# EasyEDA Pro project FLIGHT-CONTROLLER-Final_VERSION-1.eprj

# Schematic FLIGHT CONTROLLER
Board Name: FLIGHT CONTROLLER; Create Date: 2025-07-13; Page Name: Sheet_1; Project Name: FLIGHT-CONTROLLER-Final_VERSION-1; Schematic Name: FLIGHT CONTROLLER; Update Date: 2025-07-13; Add into BOM: yes; Company: Your Company; Convert to PCB: yes; Date: 2025-07-08; Draw By: Jinalka Herath; REV: 1.0; Sheet: 1/1; spicePre: .
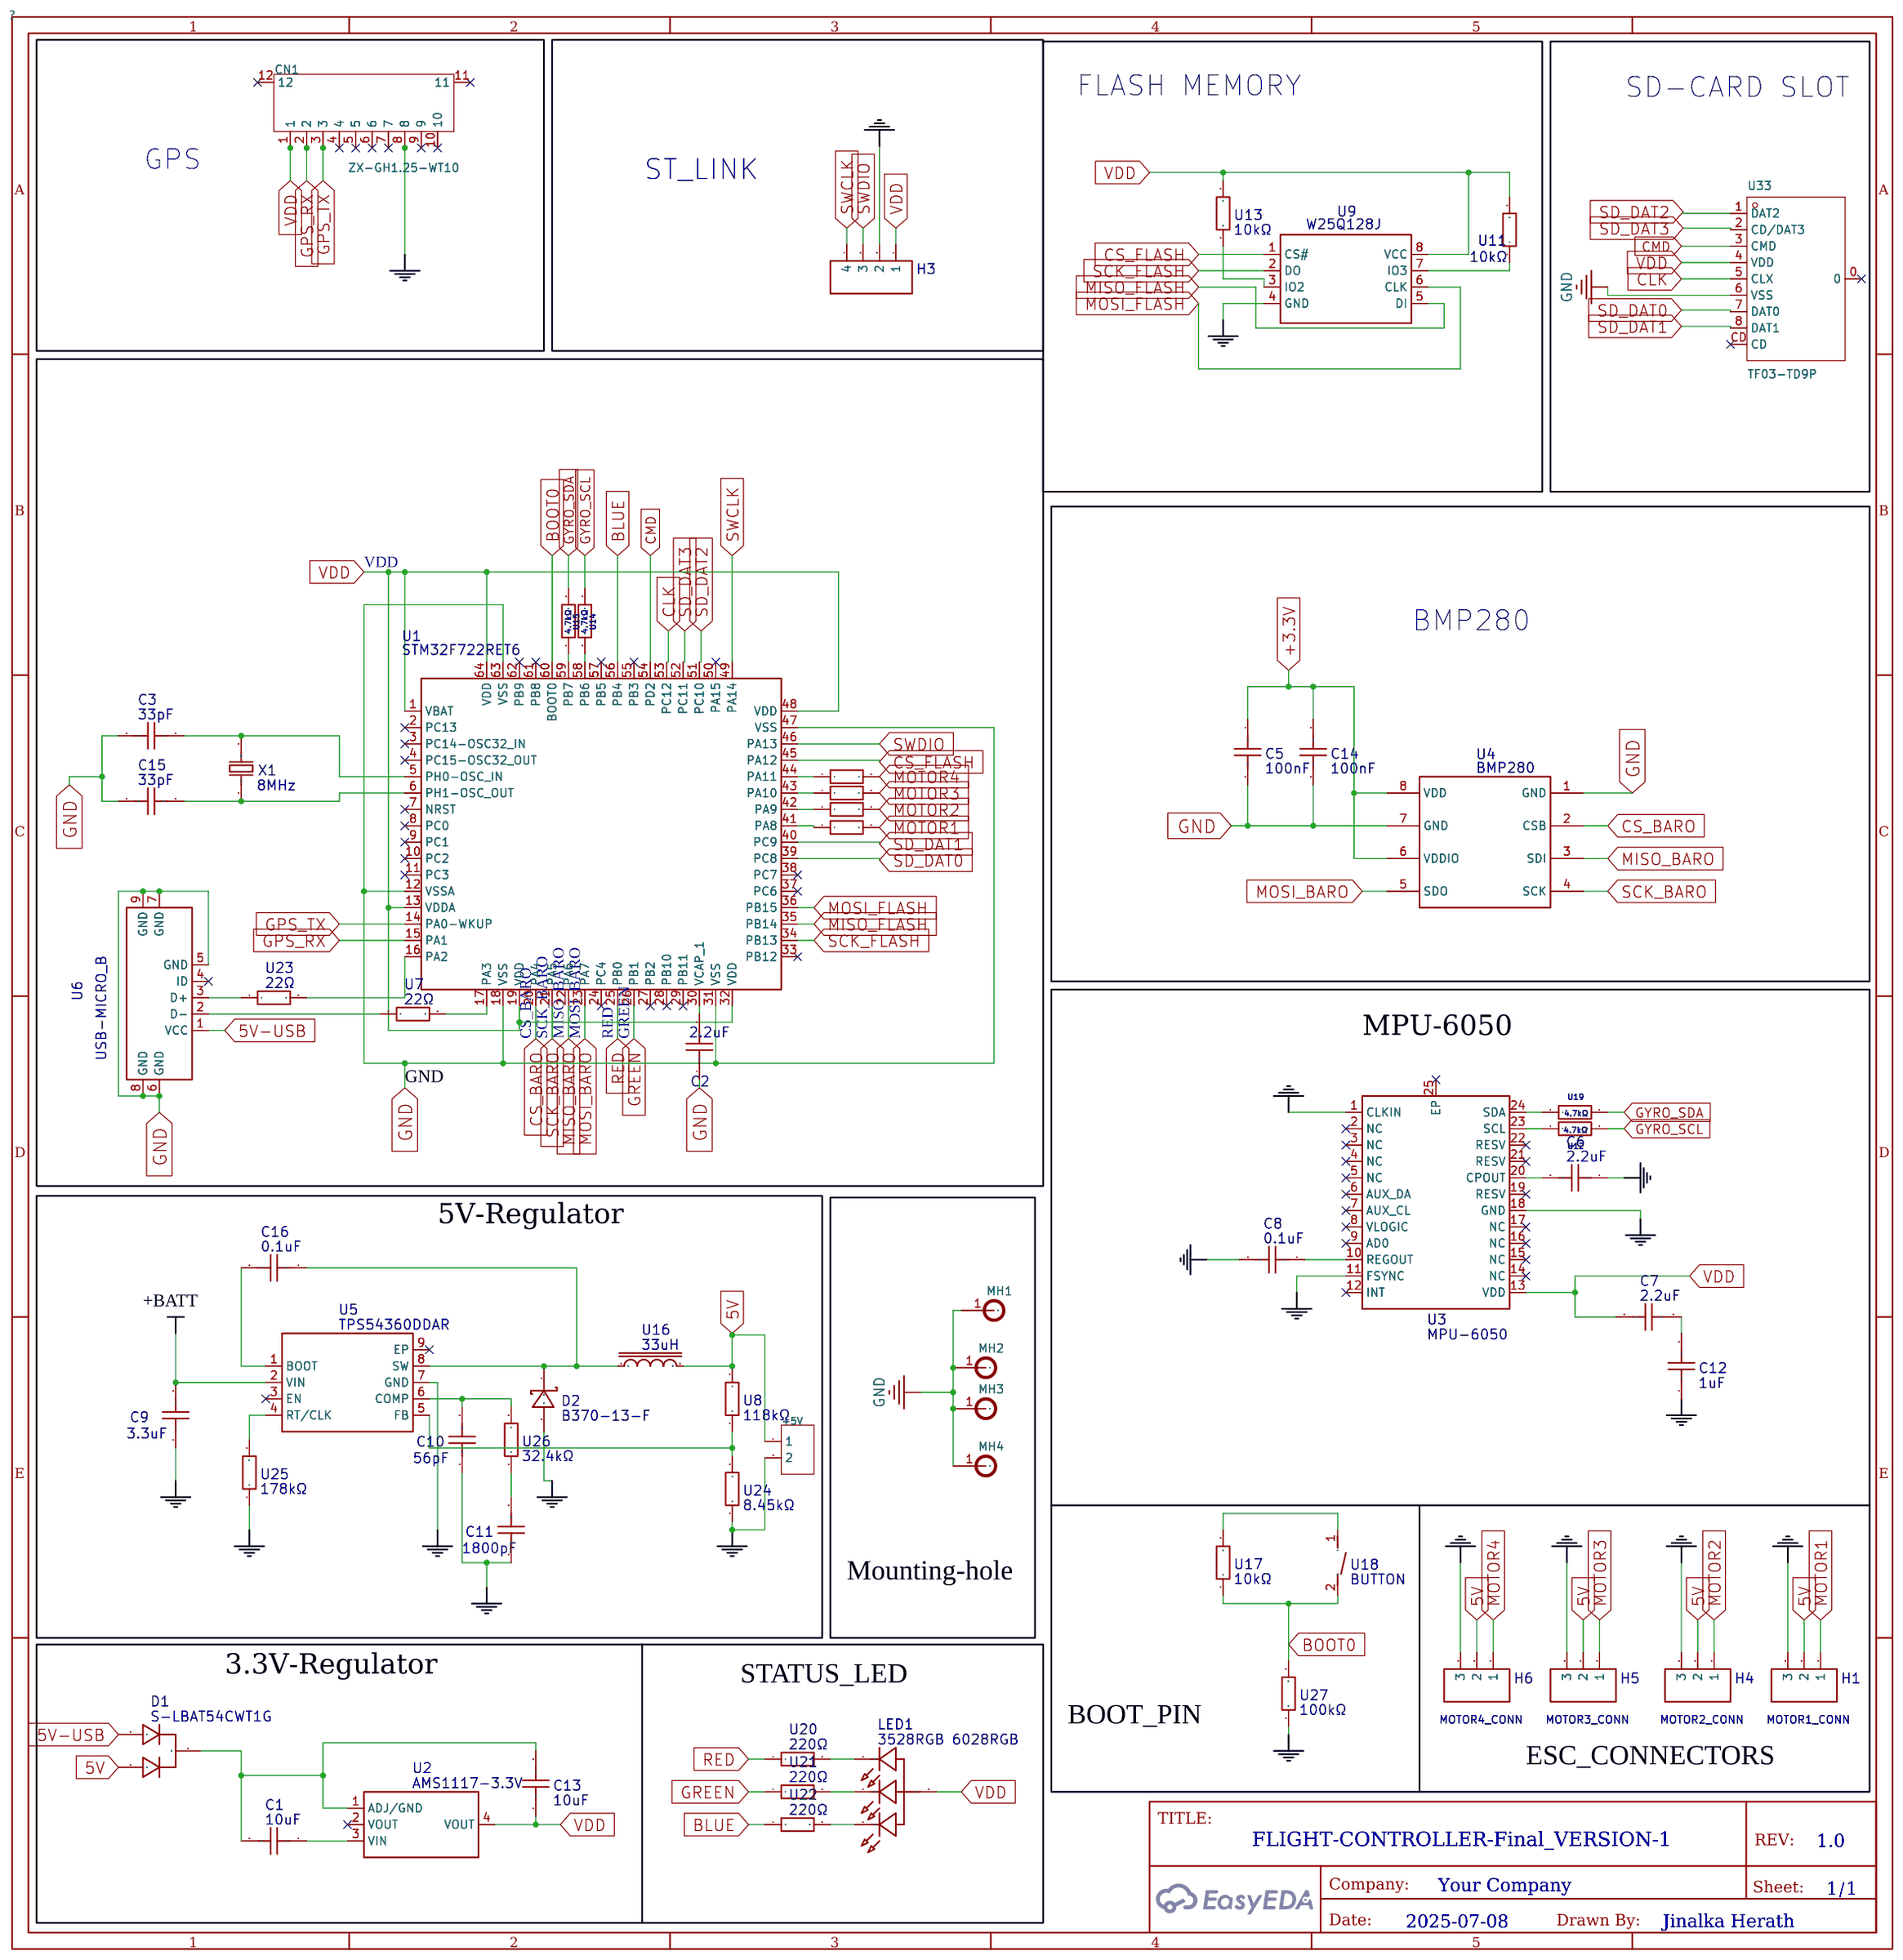
[diagram p0: schematic sheet]

## Parts
+5V  -  [HDR-TH_2P-P2.54-V-F]
C1  10uF  [C0603]
C2  2.2uF  [CAP-SMD_L3.2-W2.5-1]
C3  33pF  [C0603]
C5  100nF  [C0603]
C6  2.2uF  [C0603]
C7  2.2uF  [C0603]
C8  0.1uF  [C0603]
C9  3.3uF  [C0603]
C10  56pF  [C0603]
C11  1800pF  [C0603]
C12  1uF  [C0603]
C13  10uF  [C0603]
C14  100nF  [C0603]
C15  33pF  [C0603]
C16  0.1uF  [C0603]
CN1  ZX-GH1.25-WT10  [CONN-SMD_ZX-GH1.25-WT10]
D1  S-LBAT54CWT1G  [SC-70-3_L2.0-W1.3-P1.30-LS2.1-BR]
D2  B370-13-F  [SMC_L7.1-W6.2-LS8.1-RD]
H1  MOTOR1_CONN  [HDR-F-2.54_1X3]
H3  ST_LINK  [HDR-F-2.54_1X4]
H4  MOTOR2_CONN  [HDR-F-2.54_1X3]
H5  MOTOR3_CONN  [HDR-F-2.54_1X3]
H6  MOTOR4_CONN  [HDR-F-2.54_1X3]
LED1  3528RGB 6028RGB  [LED-SMD_4P-L3.5-W2.8_3528RGB-6028RGB]
MH1  -  [MH_7.5]  (no BOM)
MH2  -  [MH_7.5]  (no BOM)
MH3  -  [MH_7.5]  (no BOM)
MH4  -  [MH_7.5]  (no BOM)
U1  STM32F722RET6  [LQFP-64_L10.0-W10.0-P0.50-LS12.0-BL]
U2  AMS1117-3.3V  [SOT-223-4_L6.5-W3.5-P2.30-LS7.0-BR]
U3  MPU-6050  [QFN-24_L4.0-W4.0-P0.50-BL-EP2.7]
U4  BMP280  [LGA-8_L2.5-W2.0-P0.65_AMP6127]
U5  TPS54360DDAR  [ESOP-8_L4.9-W3.9-P1.27-LS6.0-BL-EP]
U6  USB-MICRO_B  [MICRO-USB-SMD_USB-MICRO_B]
U7  22Ω  [RES-TH_BD2.3-L3.7-P7.70-D0.9]
U8  118kΩ  [RES-TH_BD2.3-L3.7-P7.70-D0.9]
U9  W25Q128J  [SOIC-8_L5.3-W5.3-P1.27-LS8.0-BL]
U11  10kΩ  [RES-TH_BD2.3-L3.7-P7.70-D0.9]
U12  4.7kΩ  [RES-TH_BD2.3-L3.7-P7.70-D0.9]
U13  10kΩ  [RES-TH_BD2.3-L3.7-P7.70-D0.9]
U14  4.7kΩ  [RES-TH_BD2.3-L3.7-P7.70-D0.9]
U15  4.7kΩ  [RES-TH_BD2.3-L3.7-P7.70-D0.9]
U16  33uH  [IND-SMD_L8.5-W8.0_SMS0850]
U17  10kΩ  [RES-TH_BD2.3-L3.7-P7.70-D0.9]
U18  BUTTON  [KEY-SMD_L6.0-W6.0-LS6.6]
U19  4.7kΩ  [RES-TH_BD2.3-L3.7-P7.70-D0.9]
U20  220Ω  [RES-TH_BD2.3-L3.7-P7.70-D0.9]
U21  220Ω  [RES-TH_BD2.3-L3.7-P7.70-D0.9]
U22  220Ω  [RES-TH_BD2.3-L3.7-P7.70-D0.9]
U23  22Ω  [RES-TH_BD2.3-L3.7-P7.70-D0.9]
U24  8.45kΩ  [RES-TH_BD2.3-L3.7-P7.70-D0.9]
U25  178kΩ  [RES-TH_BD2.3-L3.7-P7.70-D0.9]
U26  32.4kΩ  [RES-TH_BD2.3-L3.7-P7.70-D0.9]
U27  100kΩ  [RES-TH_BD2.3-L3.7-P7.70-D0.9]
U28  100Ω  [RES-TH_BD2.3-L3.7-P7.70-D0.9]
U29  100Ω  [RES-TH_BD2.3-L3.7-P7.70-D0.9]
U30  100Ω  [RES-TH_BD2.3-L3.7-P7.70-D0.9]
U33  TF03-TD9P  [CONN-SMD_TF-001A-P]
U34  100Ω  [RES-TH_BD2.3-L3.7-P7.70-D0.9]
X1  8MHz  [CRYSTAL-SMD_L3.2-W2.5_3225-8MHZ]

## Library data of the parts
+5V = HDR-F_2.54_1x2P: Supplier Footprint: Through
C1 C13 = 10uF: Supplier: LCSC; Supplier Part: C3884822; Manufacturer: TDK; Manufacturer Part: C1608CH2A560J080AA; JLCPCB Part Class: Extended Part; Contributor: lcsc; nameAlias: Value; spicePre: C; spiceSymbolName: C1608CH2A560J080AA
C2 = 2.2uF: Supplier: LCSC; Supplier Part: C3778570; Manufacturer: rubycon(红宝石); Manufacturer Part: 25MU225MB23225; JLCPCB Part Class: Extended Part; Contributor: lcsc; nameAlias: Value; spicePre: C; spiceSymbolName: 25MU225MB23225
C3 C15 = 33pF: Supplier: LCSC; Supplier Part: C3884822; Manufacturer: TDK; Manufacturer Part: C1608CH2A560J080AA; JLCPCB Part Class: Extended Part; Contributor: lcsc; nameAlias: Value; spicePre: C; spiceSymbolName: C1608CH2A560J080AA
C5 C14 = 100nF: Supplier: LCSC; Supplier Part: C3884822; Manufacturer: TDK; Manufacturer Part: C1608CH2A560J080AA; JLCPCB Part Class: Extended Part; Contributor: lcsc; nameAlias: Value; spicePre: C; spiceSymbolName: C1608CH2A560J080AA
C6 C7 = 2.2uF: Supplier: LCSC; Supplier Part: C3884822; Manufacturer: TDK; Manufacturer Part: C1608CH2A560J080AA; JLCPCB Part Class: Extended Part; Contributor: lcsc; nameAlias: Value; spicePre: C; spiceSymbolName: C1608CH2A560J080AA
C8 C16 = 0.1uF: Supplier: LCSC; Supplier Part: C3884822; Manufacturer: TDK; Manufacturer Part: C1608CH2A560J080AA; JLCPCB Part Class: Extended Part; Contributor: lcsc; nameAlias: Value; spicePre: C; spiceSymbolName: C1608CH2A560J080AA
C9 = 3.3uF: Supplier: LCSC; Supplier Part: C3884822; Manufacturer: TDK; Manufacturer Part: C1608CH2A560J080AA; JLCPCB Part Class: Extended Part; Contributor: lcsc; nameAlias: Value; spicePre: C; spiceSymbolName: C1608CH2A560J080AA
C10 = 56pF: Supplier: LCSC; Supplier Part: C3884822; Manufacturer: TDK; Manufacturer Part: C1608CH2A560J080AA; JLCPCB Part Class: Extended Part; Contributor: lcsc; nameAlias: Value; spicePre: C; spiceSymbolName: C1608CH2A560J080AA
C11 = 1800pF: Supplier: LCSC; Supplier Part: C3884822; Manufacturer: TDK; Manufacturer Part: C1608CH2A560J080AA; JLCPCB Part Class: Extended Part; Contributor: lcsc; nameAlias: Value; spicePre: C; spiceSymbolName: C1608CH2A560J080AA
C12 = 1uF: Supplier: LCSC; Supplier Part: C3884822; Manufacturer: TDK; Manufacturer Part: C1608CH2A560J080AA; JLCPCB Part Class: Extended Part; Contributor: lcsc; nameAlias: Value; spicePre: C; spiceSymbolName: C1608CH2A560J080AA
CN1 = ZX-GH1.25-WT10: Pins Structure:1x10P Pitch:1.25mm Mounting Type:Surface Mount, Right Angle Reference Series:GH Number of Pins:10P Number of Rows:1 Number of PINs Per Row:10 Row Spacing:- Current Rating:1A Contact Material:Phosphor Bronze Contact Plating:Tin Operating Tem; LCSC Part Name: 1x10P 间距:1.25mm 卧贴 系列:GH; Supplier Part: C7429523; Manufacturer: Megastar(兆星); Supplier Footprint: SMD,P=1.25mm,卧贴; JLCPCB Part Class: Extended Part; Datasheet: https://atta.szlcsc.com/upload/public/pdf/source/20230619/4B2B28B10338DA0EF18CC8BF26211619.pdf; Supplier: LCSC; Pins Structure: 1x10P; Pitch: 1.25mm; Mounting Type: Surface Mount, Right Angle; Reference Series: GH; Number of Pins: 10P; Number of Rows: 1; Number of PINs Per Row: 10; Current Rating: 1A; Contact Material: Phosphor Bronze; Contact Plating: Tin; Operating Temperature: -25℃~+85℃; Voltage Rating: 125V; Plastic Material: LCP; Supplementary Features: Auxiliary Solder Pin; Color: Beige; Z-Height of the Board: 4.35mm; X-Length of Bottom Edge on Board (Spacing Line): 15.75mm; Y-Width of Bottom Edge on Board: 5mm
D1 = S-LBAT54CWT1G: Supplier: LCSC; Supplier Part: C2941716; Manufacturer: LRC(乐山无线电); JLCPCB Part Class: Extended Part; Contributor: lcsc; spicePre: D
D2 = B370-13-F: Supplier Part: C134456; Supplier: LCSC; Manufacturer: DIODES(美台); JLCPCB Part Class: Extended Part; Contributor: LCSC; spicePre: D
H1 = MOTOR1_CONN: Supplier Part: C146690; Supplier: LCSC; Contributor: LCEDA_Lib; spicePre: H; spiceSymbolName: HDR-F-2.54_1x3
H3 = ST_LINK: Supplier Part: C225501; Supplier: LCSC; Contributor: LCEDA_Lib; spicePre: H; spiceSymbolName: HDR-F-2.54_1x4
H4 = MOTOR2_CONN: Supplier Part: C146690; Supplier: LCSC; Contributor: LCEDA_Lib; spicePre: H; spiceSymbolName: HDR-F-2.54_1x3
H5 = MOTOR3_CONN: Supplier Part: C146690; Supplier: LCSC; Contributor: LCEDA_Lib; spicePre: H; spiceSymbolName: HDR-F-2.54_1x3
H6 = MOTOR4_CONN: Supplier Part: C146690; Supplier: LCSC; Contributor: LCEDA_Lib; spicePre: H; spiceSymbolName: HDR-F-2.54_1x3
LED1 = 3528RGB 6028RGB: Supplier: LCSC; Supplier Part: C9900020542; Manufacturer: null; Manufacturer Part: 3528反贴RGB 6028反贴RGB 缺口蓝色; JLCPCB Part Class: Extended Part; Contributor: lcsc; spicePre: L
MH1-MH4 = MH_7.5
U1 = STM32F722RET6: Supplier: LCSC; Supplier Part: C118207; Manufacturer: ST(意法半导体); JLCPCB Part Class: Extended Part; Contributor: LCSC; spicePre: U
U2 = AMS1117-3.3V: Supplier: LCSC; Supplier Part: C2688239; Manufacturer: WPMtek(维攀); JLCPCB Part Class: Extended Part; Contributor: LCSC; spicePre: U
U3 = MPU-6050_C24112: Supplier: LCSC; Manufacturer: TDK InvenSense(应美盛); Supplier Part: C24112; JLCPCB Part Class: Extended Part; sourceId: 1T5FDZYC8; timeStamp: 1462265206; spicePre: U
U4 = BMP280: Supplier: LCSC; Manufacturer: Bosch(博世); Supplier Part: C83291; JLCPCB Part Class: Extended Part; spicePre: U
U5 = TPS54360DDAR(TOKMAS): Supplier: LCSC; Supplier Part: C7525413; Manufacturer: Tokmas(托克马斯); JLCPCB Part Class: Extended Part; Contributor: lcsc; spicePre: U
U6 = USB-MICRO_B: Supplier: LCSC; Supplier Part: C9900001367; Manufacturer: null; JLCPCB Part Class: Extended Part; Contributor: LCSC; spicePre: U
U7 U23 = 22Ω: Supplier: LCSC; Supplier Part: C2848572; Manufacturer: VO(翔胜); Manufacturer Part: MF1/8W-220Ω±1%-ST52; JLCPCB Part Class: Extended Part; Contributor: lcsc; nameAlias: Value; spicePre: U; spiceSymbolName: MF1/8W-220Ω±1%-ST52; Package Display: No
U8 = 118kΩ: Supplier: LCSC; Supplier Part: C2848572; Manufacturer: VO(翔胜); Manufacturer Part: MF1/8W-220Ω±1%-ST52; JLCPCB Part Class: Extended Part; Contributor: lcsc; nameAlias: Value; spicePre: U; spiceSymbolName: MF1/8W-220Ω±1%-ST52; Package Display: No
U9 = W25Q128JVSIQTR: Supplier: LCSC; Manufacturer: WINBOND(华邦); Manufacturer Part: W25Q128JVSIQ; Supplier Part: C97521; JLCPCB Part Class: Basic Part; spicePre: U
U11 U13 U17 = 10kΩ: Supplier: LCSC; Supplier Part: C2848572; Manufacturer: VO(翔胜); Manufacturer Part: MF1/8W-220Ω±1%-ST52; JLCPCB Part Class: Extended Part; Contributor: lcsc; nameAlias: Value; spicePre: U; spiceSymbolName: MF1/8W-220Ω±1%-ST52; Package Display: No
U12 U14 U15 U19 = 4.7kΩ: Supplier: LCSC; Supplier Part: C2848572; Manufacturer: VO(翔胜); Manufacturer Part: MF1/8W-220Ω±1%-ST52; JLCPCB Part Class: Extended Part; Contributor: lcsc; nameAlias: Value; spicePre: U; spiceSymbolName: MF1/8W-220Ω±1%-ST52; Package Display: No
U16 = 33uH: Supplier: LCSC; Supplier Part: C7602869; Manufacturer: LanTu Micro(蓝图微电); Manufacturer Part: SMS0850-330MT; JLCPCB Part Class: Extended Part; nameAlias: Value; Contributor: lcsc; spicePre: U; spiceSymbolName: SMS0850-330MT
U18 = BUTTON: Supplier: LCSC; Supplier Part: C9900040040; Manufacturer: null; JLCPCB Part Class: Extended Part; Contributor: lcsc; spicePre: U; spiceSymbolName: BUTTON_C9900040040
U20-U22 = 220Ω: Supplier: LCSC; Supplier Part: C2848572; Manufacturer: VO(翔胜); Manufacturer Part: MF1/8W-220Ω±1%-ST52; JLCPCB Part Class: Extended Part; Contributor: lcsc; nameAlias: Value; spicePre: U; spiceSymbolName: MF1/8W-220Ω±1%-ST52; Package Display: No
U24 = 8.45kΩ: Supplier: LCSC; Supplier Part: C2848572; Manufacturer: VO(翔胜); Manufacturer Part: MF1/8W-220Ω±1%-ST52; JLCPCB Part Class: Extended Part; Contributor: lcsc; nameAlias: Value; spicePre: U; spiceSymbolName: MF1/8W-220Ω±1%-ST52; Package Display: No
U25 = 178kΩ: Supplier: LCSC; Supplier Part: C2848572; Manufacturer: VO(翔胜); Manufacturer Part: MF1/8W-220Ω±1%-ST52; JLCPCB Part Class: Extended Part; Contributor: lcsc; nameAlias: Value; spicePre: U; spiceSymbolName: MF1/8W-220Ω±1%-ST52; Package Display: No
U26 = 32.4kΩ: Supplier: LCSC; Supplier Part: C2848572; Manufacturer: VO(翔胜); Manufacturer Part: MF1/8W-220Ω±1%-ST52; JLCPCB Part Class: Extended Part; Contributor: lcsc; nameAlias: Value; spicePre: U; spiceSymbolName: MF1/8W-220Ω±1%-ST52; Package Display: No
U27 = 100kΩ: Supplier: LCSC; Supplier Part: C2848572; Manufacturer: VO(翔胜); Manufacturer Part: MF1/8W-220Ω±1%-ST52; JLCPCB Part Class: Extended Part; Contributor: lcsc; nameAlias: Value; spicePre: U; spiceSymbolName: MF1/8W-220Ω±1%-ST52; Package Display: No
U28-U30 U34 = 100Ω: Supplier: LCSC; Supplier Part: C2848572; Manufacturer: VO(翔胜); Manufacturer Part: MF1/8W-220Ω±1%-ST52; JLCPCB Part Class: Extended Part; Contributor: lcsc; nameAlias: Value; spicePre: U; spiceSymbolName: MF1/8W-220Ω±1%-ST52; Package Display: No
U33 = TF03-TD9P: LCSC Part Name: 自弹式 MicroSD(TF卡）卡座; Supplier Part: C36936584; Manufacturer: BXCONN(宝讯); Supplier Footprint: SMD; Datasheet: https://atta.szlcsc.com/upload/public/pdf/source/20240731/E1986EBDAECF71B60F867BC7213E5175.pdf; Supplier: LCSC
X1 = 8MHz: Supplier: LCSC; Supplier Part: C42448903; Manufacturer: YXC(扬兴晶振); Manufacturer Part: X22EL89COI-111YLC-8M; JLCPCB Part Class: Extended Part; Contributor: lcsc; nameAlias: Value; spicePre: X; spiceSymbolName: X22EL89COI-111YLC-8M

## Nets
5V: +5V.1 D1.2 H1.2 H4.2 H5.2 H6.2 U8.2 U16.2
5V-USB: D1.1 U6.1(VCC)
+3.3V: C5.1 C14.1 U4.6(VDDIO) U4.8(VDD)
GND: +5V.2 C2.1 C3.1 C5.2 C6.1 C8.2 C9.1 C10.1 C11.1 C12.2 C14.2 C15.1 CN1.8 D2.2(A) H1.3 H3.2 H4.3 H5.3 H6.3 MH1.1 MH2.1 MH3.1 MH4.1 U1.12(VSSA) U1.18(VSS) U1.31(VSS) U1.47(VSS) U1.63(VSS) U3.1(CLKIN) U3.11(FSYNC) U3.18(GND) U4.1(GND) U4.7(GND) U5.7(GND) U6.5(GND) U6.6(GND) U6.7(GND) U6.8(GND) U6.9(GND) U9.4(GND) U24.1 U25.1 U27.1 U33.6(VSS)
VDD: C7.2 C13.2 CN1.1 H3.1 LED1.3(A) U1.1(VBAT) U1.13(VDDA) U1.19(VDD) U1.32(VDD) U1.48(VDD) U1.64(VDD) U2.4(VOUT) U3.13(VDD) U9.8(VCC) U11.2 U13.2 U33.4(VDD)
+BATT: C9.2 U5.2(VIN)
BLUE: U1.56(PB4) U22.1
BOOT0: U1.60(BOOT0) U17.1 U18.2(B) U27.2
CLK: U1.53(PC12) U33.5(CLX)
CMD: U1.54(PD2) U33.3(CMD)
CS_BARO: U1.20(PA4) U4.2(CSB)
CS_FLASH: U1.45(PA12) U9.1(CS#)
GPS_RX: CN1.2 U1.15(PA1)
GPS_TX: CN1.3 U1.14(PA0-WKUP)
GREEN: U1.26(PB1) U21.1
GYRO_SCL: U12.2 U14.2
GYRO_SDA: U15.2 U19.2
MISO_BARO: U1.22(PA6) U4.3(SDI)
MISO_FLASH: U1.35(PB14) U9.5(DI)
MOSI_BARO: U1.23(PA7) U4.5(SDO)
MOSI_FLASH: U1.36(PB15) U9.6(CLK)
MOTOR1: H1.1 U34.2
MOTOR2: H4.1 U29.2
MOTOR3: H5.1 U28.2
MOTOR4: H6.1 U30.2
RED: U1.25(PB0) U20.1
SCK_BARO: U1.21(PA5) U4.4(SCK)
SCK_FLASH: U1.34(PB13) U9.2(DO)
SD_DAT0: U1.39(PC8) U33.7(DAT0)
SD_DAT1: U1.40(PC9) U33.8(DAT1)
SD_DAT2: U1.51(PC10) U33.1(DAT2)
SD_DAT3: U1.52(PC11) U33.2(CD/DAT3)
SWCLK: H3.4 U1.49(PA14)
SWDIO: H3.3 U1.46(PA13)
$1N1: U1.17(PA3) U7.2
$1N2: U6.2(D-) U7.1
$1N3: U1.16(PA2) U23.2
$1N4: U6.3(D+) U23.1
$1N7: C2.2 U1.30(VCAP_1)
$1N9: C3.2 U1.5(PH0-OSC_IN) X1.2
$1N10: C15.2 U1.6(PH1-OSC_OUT) X1.1
$1N15: C8.1 U3.10(REGOUT)
$1N18: C7.1 C12.1
$1N20: C6.2 U3.20(CPOUT)
$1N23: C1.2 C13.1 D1.3 U2.1(ADJ/GND)
$1N24: C1.1 U2.3(VIN)
$1N49: U9.3(IO2) U13.1
$1N50: U9.7(IO3) U11.1
$1N54: U1.42(PA9) U29.1
$1N55: U1.43(PA10) U28.1
$1N56: U1.44(PA11) U30.1
$1N58: U3.24(SDA) U19.1
$1N60: U3.23(SCL) U12.1
$1N63: U1.58(PB6) U14.1
$1N64: U1.59(PB7) U15.1
$1N71: U1.41(PA8) U34.1
$1N83: C16.2 U5.1(BOOT)
$1N84: C16.1 D2.1(C) U5.8(SW) U16.1
$1N87: C10.2 U5.6(COMP) U26.2
$1N88: C11.2 U26.1
$1N90: U5.4(RT/CLK) U25.2
$1N93: U5.5(FB) U8.1 U24.2
$1N107: U17.2 U18.1(A)
$1N112: LED1.2(R) U20.2
$1N113: LED1.1(B) U21.2
$1N114: LED1.4(G) U22.2

Not connected (* = marked no-connect by the designer): CN1 4* 5* 6* 7* 9* 10* 11* 12*; U1 2(PC13)* 3(PC14-OSC32_IN)* 4(PC15-OSC32_OUT)* 7(NRST)* 8(PC0)* 9(PC1)* 10(PC2)* 11(PC3)* 24(PC4)* 27(PB2)* 28(PB10)* 29(PB11)* 33(PB12)* 37(PC6)* 38(PC7)* 50(PA15)* 55(PB3)* 57(PB5)* 61(PB8)* 62(PB9)*; U2 2(VOUT)*; U3 2(NC)* 3(NC)* 4(NC)* 5(NC)* 6(AUX_DA)* 7(AUX_CL)* 8(VLOGIC)* 9(AD0)* 12(INT)* 14(NC)* 15(NC)* 16(NC)* 17(NC)* 19(RESV)* 21(RESV)* 22(RESV)* 25(EP)*; U5 3(EN)* 9(EP)*; U6 4(ID)*; U33 0* CD*

## Notes on the sheet
- FLASH MEMORY
- SD-CARD SLOT
- GPS
- BMP280
- MPU-6050
- 5V-Regulator
- +BATT
- Mounting-hole
- 3.3V-Regulator
- STATUS_LED
- BOOT_PIN
- ESC_CONNECTORS

# Board PCB3
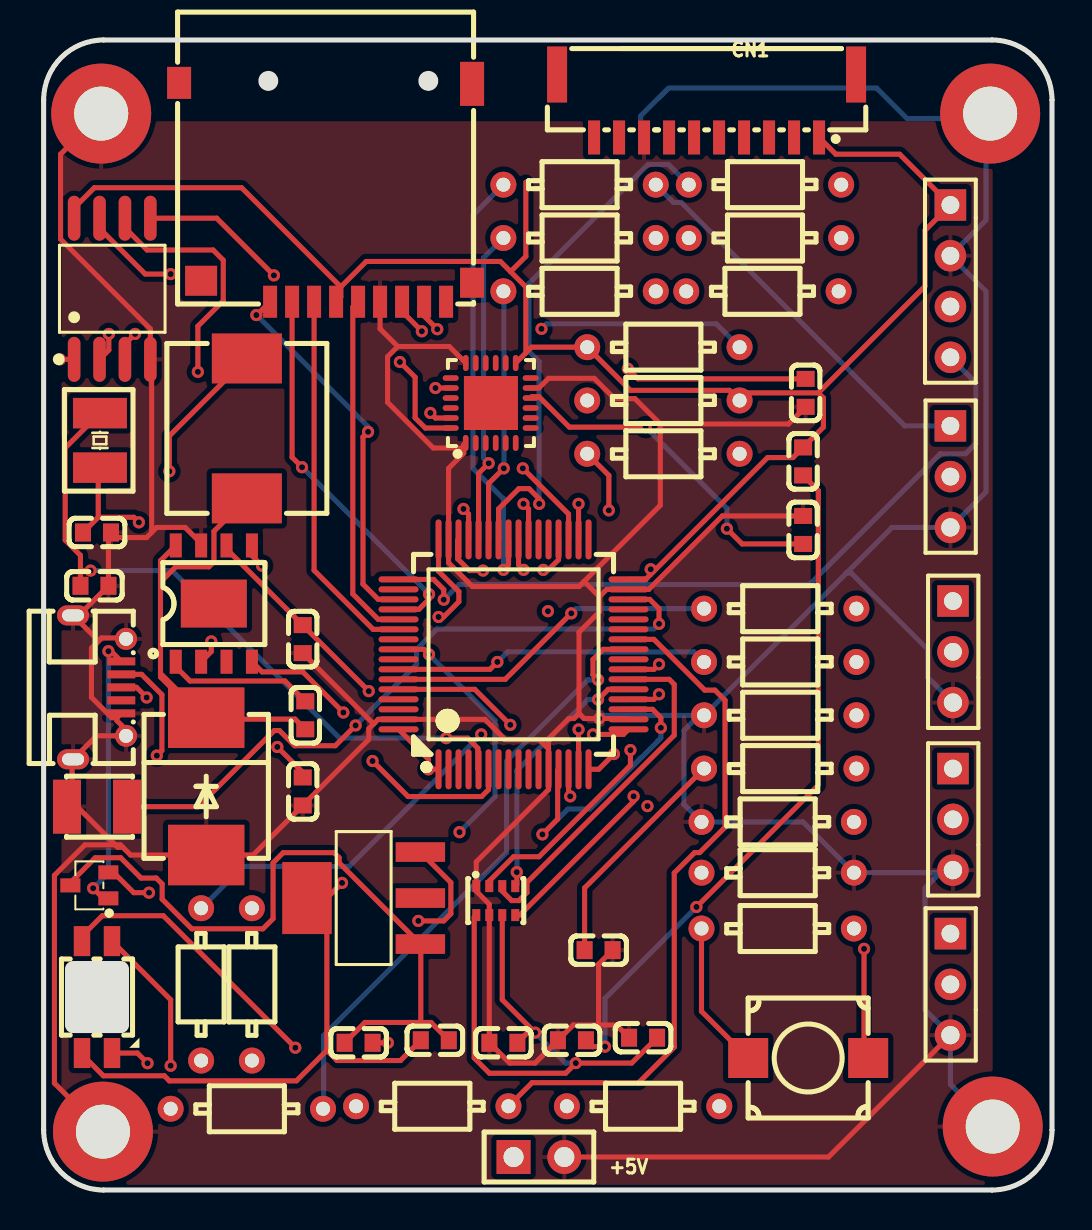
[diagram p1: board, top side]
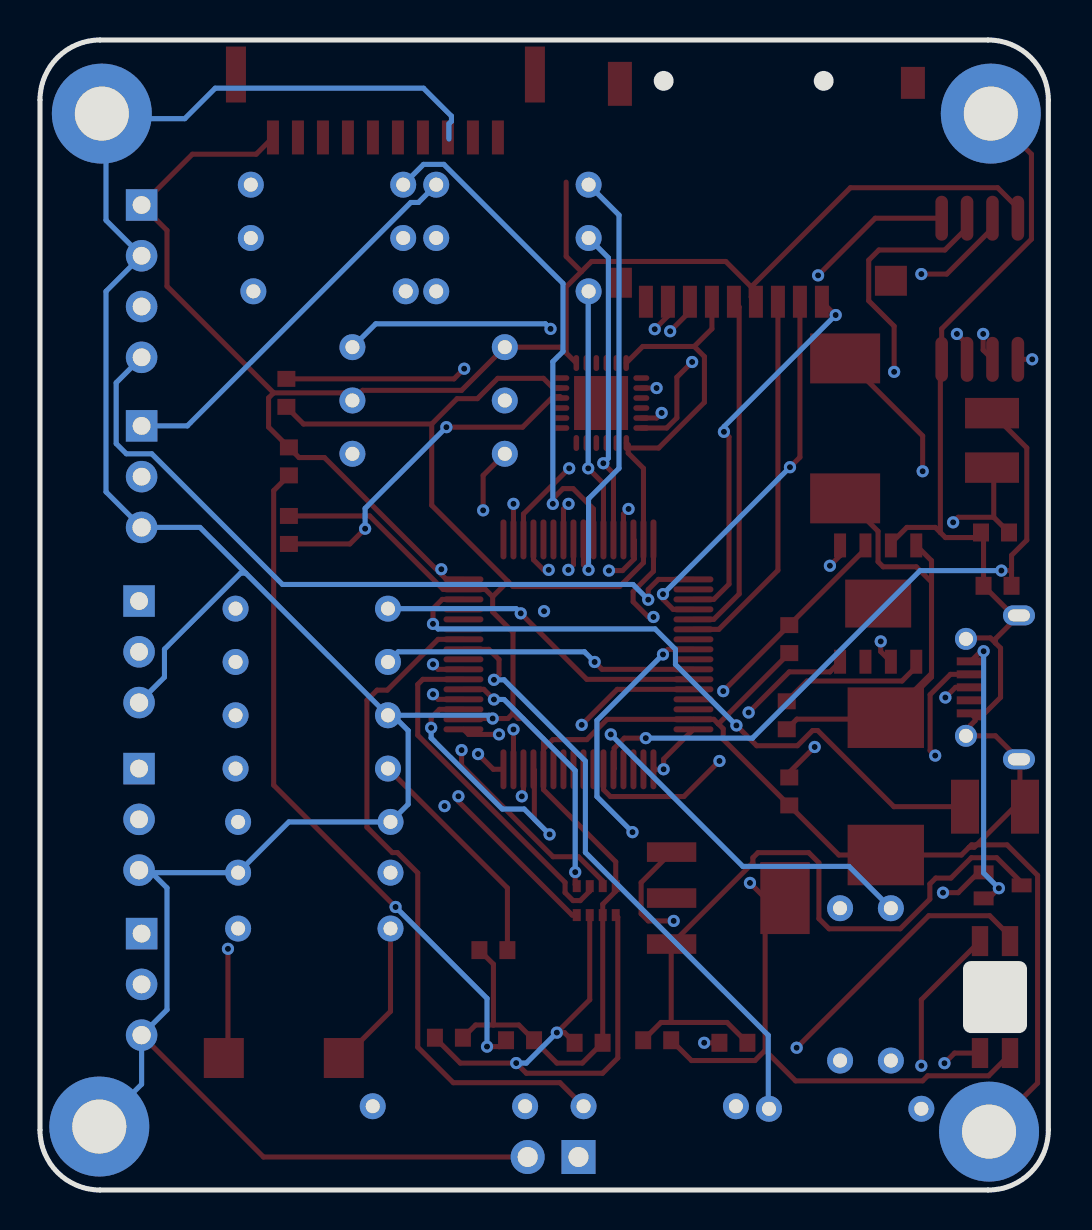
[diagram p2: board, bottom side, seen from below]

Outline 50.42 x 57.53 mm; copper layers: Top Layer, Inner1, Inner2, Bottom Layer. Coordinates in mm from the lower left corner of the outline.
Outline path: 0,54.53 0,3 arc(0.88,0.88) 3,0 47.42,0 arc(49.54,0.88) 50.42,3 50.42,54.53 arc(49.54,56.65) 47.42,57.53 3,57.53 arc(0.88,56.65) 0,54.53
Stack: Top Layer 0.035mm Outer layer thickness 1oz / Dielectric1 0.2104mm 7628 RC49% 8.6mil / Inner1 0.0152mm Inner layer thickness / Dielectric2 1.065mm 1.1mm H/HOZ Copper / Inner2 0.0152mm Inner layer thickness / Dielectric3 0.2104mm 7628 RC49% 8.6mil / Bottom Layer 0.035mm Outer layer thickness 1oz

## Design rules (mm)
template: JLCPCB Capability(Two Layers Board)
spacing copperThickness1oz (default): track to track 0.102, other pairs 0.152 to 0.3
spacing copperThickness2oz: track to track 0.203, other pairs 0.152 to 0.3
track width copperThickness1oz (default): min 0.127, default 0.254, max 2.54
track width copperThickness2oz: min 0.203, default 0.254, max 2.54
differential pair differentialPair (default): width min 0.127, default 0.254, max 2.54; gap min 0.152, default 0.152
via viaSize (default): diameter min 0.5, default 0.61, max 10; hole min 0.3, default 0.305, max 6.3
net +3.3V uses copperThickness2oz
net +BATT uses copperThickness2oz
net 5V uses copperThickness2oz
net 5V-USB uses copperThickness2oz
pour e64083 uses copperRegion

## Placement (name value [footprint] x y rotation side)
+5V  -  [HDR-TH_2P-P2.54-V-F]  24.76 1.65 0 top
C1  10uF  [C0603]  15.75 7.37 180 top
C2  2.2uF  [CAP-SMD_L3.2-W2.5-1]  2.67 19.18 0 top
C3  33pF  [C0603]  2.54 30.23 180 top
C5  100nF  [C0603]  29.97 7.62 180 top
C6  2.2uF  [C0603]  38.1 39.88 90 top
C7  2.2uF  [C0603]  37.97 36.45 90 top
C8  0.1uF  [C0603]  37.97 33.02 90 top
C9  3.3uF  [C0603]  12.95 19.94 90 top
C10  56pF  [C0603]  12.95 27.56 90 top
C11  1800pF  [C0603]  27.75 12 180 top
C12  1uF  [C0603]  26.42 7.49 180 top
C13  10uF  [C0603]  19.56 7.49 180 top
C14  100nF  [C0603]  22.99 7.37 180 top
C15  33pF  [C0603]  2.67 32.89 180 top
C16  0.1uF  [C0603]  13.08 23.75 90 top
CN1  ZX-GH1.25-WT10  [CONN-SMD_ZX-GH1.25-WT10]  33.15 54.23 180 top
D1  S-LBAT54CWT1G  [SC-70-3_L2.0-W1.3-P1.30-LS2.1-BR]  2.29 15.24 0 top
D2  B370-13-F  [SMC_L7.1-W6.2-LS8.1-RD]  8.13 20.19 270 top
H1  MOTOR1_CONN  [HDR-F-2.54_1X3]  45.34 35.69 270 top
H3  ST_LINK  [HDR-F-2.54_1X4]  45.34 45.47 270 top
H4  MOTOR2_CONN  [HDR-F-2.54_1X3]  45.47 26.92 270 top
H5  MOTOR3_CONN  [HDR-F-2.54_1X3]  45.47 18.54 270 top
H6  MOTOR4_CONN  [HDR-F-2.54_1X3]  45.34 10.29 270 top
LED1  3528RGB 6028RGB  [LED-SMD_4P-L3.5-W2.8_3528RGB-6028RGB]  2.67 9.65 90 top
MH1  -  [MH_7.5]  2.88 54.23 0 top
MH2  -  [MH_7.5]  2.97 3.3 0 top
MH3  -  [MH_7.5]  47.33 54.23 0 top
MH4  -  [MH_7.5]  47.45 3.56 0 top
U1  STM32F722RET6  [LQFP-64_L10.0-W10.0-P0.50-LS12.0-BL]  23.5 26.8 0 top
U2  AMS1117-3.3V  [SOT-223-4_L6.5-W3.5-P2.30-LS7.0-BR]  16 14.61 0 top
U3  MPU-6050  [QFN-24_L4.0-W4.0-P0.50-BL-EP2.7]  22.35 39.37 0 top
U4  BMP280  [LGA-8_L2.5-W2.0-P0.65_AMP6127]  22.61 14.48 90 top
U5  TPS54360DDAR  [ESOP-8_L4.9-W3.9-P1.27-LS6.0-BL-EP]  8.51 29.34 0 top
U6  USB-MICRO_B  [MICRO-USB-SMD_USB-MICRO_B]  2.79 25.15 270 top
U7  22Ω  [RES-TH_BD2.3-L3.7-P7.70-D0.9]  7.87 10.29 90 top
U8  118kΩ  [RES-TH_BD2.3-L3.7-P7.70-D0.9]  10.41 10.29 90 top
U9  W25Q128J  [SOIC-8_L5.3-W5.3-P1.27-LS8.0-BL]  3.43 45.09 0 top
U11  10kΩ  [RES-TH_BD2.3-L3.7-P7.70-D0.9]  30.99 39.5 0 top
U12  4.7kΩ  [RES-TH_BD2.3-L3.7-P7.70-D0.9]  35.94 44.96 0 top
U13  10kΩ  [RES-TH_BD2.3-L3.7-P7.70-D0.9]  30.99 42.16 180 top
U14  4.7kΩ  [RES-TH_BD2.3-L3.7-P7.70-D0.9]  36.83 26.42 0 top
U15  4.7kΩ  [RES-TH_BD2.3-L3.7-P7.70-D0.9]  36.83 29.08 0 top
U16  33uH  [IND-SMD_L8.5-W8.0_SMS0850]  10.16 38.1 90 top
U17  10kΩ  [RES-TH_BD2.3-L3.7-P7.70-D0.9]  36.7 13.08 180 top
U18  BUTTON  [KEY-SMD_L6.0-W6.0-LS6.6]  38.23 6.6 0 top
U19  4.7kΩ  [RES-TH_BD2.3-L3.7-P7.70-D0.9]  36.07 47.62 0 top
U20  220Ω  [RES-TH_BD2.3-L3.7-P7.70-D0.9]  10.16 4.06 180 top
U21  220Ω  [RES-TH_BD2.3-L3.7-P7.70-D0.9]  19.43 4.19 180 top
U22  220Ω  [RES-TH_BD2.3-L3.7-P7.70-D0.9]  29.97 4.19 180 top
U23  22Ω  [RES-TH_BD2.3-L3.7-P7.70-D0.9]  30.99 36.83 180 top
U24  8.45kΩ  [RES-TH_BD2.3-L3.7-P7.70-D0.9]  36.7 18.42 0 top
U25  178kΩ  [RES-TH_BD2.3-L3.7-P7.70-D0.9]  36.83 23.75 0 top
U26  32.4kΩ  [RES-TH_BD2.3-L3.7-P7.70-D0.9]  36.83 21.08 0 top
U27  100kΩ  [RES-TH_BD2.3-L3.7-P7.70-D0.9]  36.7 15.88 180 top
U28  100Ω  [RES-TH_BD2.3-L3.7-P7.70-D0.9]  26.8 44.96 0 top
U29  100Ω  [RES-TH_BD2.3-L3.7-P7.70-D0.9]  36.07 50.29 0 top
U30  100Ω  [RES-TH_BD2.3-L3.7-P7.70-D0.9]  26.8 47.62 0 top
U33  TF03-TD9P  [CONN-SMD_TF-001A-P]  14.1 49.91 180 top
U34  100Ω  [RES-TH_BD2.3-L3.7-P7.70-D0.9]  26.8 50.29 0 top
X1  8MHz  [CRYSTAL-SMD_L3.2-W2.5_3225-8MHZ]  2.82 37.5 90 top

## Footprints (pads in the part's own frame, mm; a bottom-side part is the same pattern mirrored in y, then rotated)
C0603
  rect 0.8x0.9 smd: 1(-0.7,0) 2(0.7,0)
CAP-SMD_L3.2-W2.5-1
  rect 1.4x2.7 smd: 1(-1.5,0) 2(1.5,0)
CONN-SMD_TF-001A-P
  rect 1.2x1.5 smd: 0(-7.325,4.524)
  rect 1.2x2.2 smd: 0(-7.325,-5.426)
  rect 1.6x1.5 smd: 0(6.225,4.426)
  rect 1.2x1.6 smd: 0(7.325,-5.474)
  rect 0.7x1.6 smd: 1(2.775,5.474) 2(1.675,5.474) 3(0.575,5.474) 4(-0.525,5.474) 5(-1.625,5.474) 6(-2.725,5.474) 7(-3.825,5.474) 8(-4.925,5.474) CD(-6.025,5.474)
CONN-SMD_ZX-GH1.25-WT10
  rect 0.6x1.7 smd: 1(-5.625,1.575) 2(-4.375,1.575) 3(-3.125,1.575) 4(-1.875,1.575) 5(-0.625,1.575) 6(0.625,1.575) 7(1.875,1.575) 8(3.125,1.575) 9(4.375,1.575) 10(5.625,1.575)
  rect 1x2.8 smd: 11(7.475,-1.575) 12(-7.475,-1.575)
CRYSTAL-SMD_L3.2-W2.5_3225-8MHZ
  rect 1.524x2.7 smd: 1(-1.362,0) 2(1.362,0)
ESOP-8_L4.9-W3.9-P1.27-LS6.0-BL-EP
  rect 0.6x1.2 smd: 1(-1.905,-2.909) 2(-0.635,-2.909) 3(0.635,-2.909) 4(1.905,-2.909) 5(1.905,2.909) 6(0.635,2.909) 7(-0.635,2.909) 8(-1.905,2.909)
  rect 3.3x2.4 smd: 9(0,0)
HDR-F-2.54_1X3
  rect 1.575x1.575 hole 0.889: 1(-2.54,0)
  round 1.575 hole 0.889: 2(0,0)
  round 1.575 hole 0.914: 3(2.54,0)
HDR-F-2.54_1X4
  rect 1.575x1.575 hole 0.889: 1(-3.81,0)
  round 1.575 hole 0.889: 2(-1.27,0) 3(1.27,0) 4(3.81,0)
HDR-TH_2P-P2.54-V-F
  rect 1.7x1.7 hole 1: 1(-1.27,0)
  round 1.7 hole 1: 2(1.27,0)
IND-SMD_L8.5-W8.0_SMS0850
  rect 2.5x3.5 smd: 1(-3.5,0) 2(3.5,0)
KEY-SMD_L6.0-W6.0-LS6.6
  rect 2x2 smd: 1(-3,0) 2(3,0)
LED-SMD_4P-L3.5-W2.8_3528RGB-6028RGB
  rect 1.5x0.82 smd: 1(-2.8,-0.75) 2(2.8,-0.75) 3(-2.8,0.75) 4(2.8,0.75)
LGA-8_L2.5-W2.0-P0.65_AMP6127
  rect 0.6x0.4 smd: 1(0.725,0.975) 2(0.725,0.325) 3(0.725,-0.325) 4(0.725,-0.975) 5(-0.725,-0.975) 6(-0.725,-0.325) 7(-0.725,0.325) 8(-0.725,0.975)
LQFP-64_L10.0-W10.0-P0.50-LS12.0-BL
  oval 0.3x2 smd: 1(-3.75,-5.75) 2(-3.25,-5.75) 3(-2.75,-5.75) 4(-2.25,-5.75) 5(-1.75,-5.75) 6(-1.25,-5.75) 7(-0.75,-5.75) 8(-0.25,-5.75) 9(0.25,-5.75) 10(0.75,-5.75) 11(1.25,-5.75) 12(1.75,-5.75) 13(2.25,-5.75) 14(2.75,-5.75) 15(3.25,-5.75) 16(3.75,-5.75) 33(3.75,5.75) 34(3.25,5.75) 35(2.75,5.75) 36(2.25,5.75) 37(1.75,5.75) 38(1.25,5.75) 39(0.75,5.75) 40(0.25,5.75) 41(-0.25,5.75) 42(-0.75,5.75) 43(-1.25,5.75) 44(-1.75,5.75) 45(-2.25,5.75) 46(-2.75,5.75) 47(-3.25,5.75) 48(-3.75,5.75)
  oval 2x0.3 smd: 17(5.75,-3.75) 18(5.75,-3.25) 19(5.75,-2.75) 20(5.75,-2.25) 21(5.75,-1.75) 22(5.75,-1.25) 23(5.75,-0.75) 24(5.75,-0.25) 25(5.75,0.25) 26(5.75,0.75) 27(5.75,1.25) 28(5.75,1.75) 29(5.75,2.25) 30(5.75,2.75) 31(5.75,3.25) 32(5.75,3.75) 49(-5.75,3.75) 50(-5.75,3.25) 51(-5.75,2.75) 52(-5.75,2.25) 53(-5.75,1.75) 54(-5.75,1.25) 55(-5.75,0.75) 56(-5.75,0.25) 57(-5.75,-0.25) 58(-5.75,-0.75) 59(-5.75,-1.25) 60(-5.75,-1.75) 61(-5.75,-2.25) 62(-5.75,-2.75) 63(-5.75,-3.25) 64(-5.75,-3.75)
MH_7.5
  round 5 hole 2.7: 1(0,-0.381)
MICRO-USB-SMD_USB-MICRO_B
  rect 0.4x1.4 smd: 1(-1.3,1.086) 2(-0.65,1.086) 3(0,1.086) 4(0.65,1.086) 5(1.3,1.086)
  oval 1x1.6 hole 0.6x1.1: 6(3.6,-1.325) 7(-3.6,-1.325)
  round 1.1 hole 0.7: 8(2.425,1.325) 9(-2.425,1.325)
QFN-24_L4.0-W4.0-P0.50-BL-EP2.7
  oval 0.28x0.8 smd: 1(-1.25,-2) 2(-0.75,-2) 3(-0.25,-2) 4(0.25,-2) 5(0.75,-2) 6(1.25,-2) 13(1.25,2) 14(0.75,2) 15(0.25,2) 16(-0.25,2) 17(-0.75,2) 18(-1.242,2)
  oval 0.8x0.28 smd: 7(2,-1.25) 8(2,-0.75) 9(2,-0.25) 10(2,0.25) 11(2,0.75) 12(2,1.25) 19(-2,1.25) 20(-2,0.75) 21(-2,0.25) 22(-2,-0.25) 23(-2,-0.75) 24(-2,-1.25)
  rect 2.7x2.7 smd: 25(0.013,0)
RES-TH_BD2.3-L3.7-P7.70-D0.9
  round 1.3 hole 0.7: 1(-3.81,0) 2(3.81,0)
SC-70-3_L2.0-W1.3-P1.30-LS2.1-BR
  rect 1x0.7 smd: 1(0.95,-0.65) 2(0.95,0.65) 3(-0.95,-0.001)
SMC_L7.1-W6.2-LS8.1-RD
  rect 3.03x3.82 smd: 1(-3.435,0) 2(3.435,0)
SOIC-8_L5.3-W5.3-P1.27-LS8.0-BL
  oval 0.63x2.25 smd: 1(-1.905,-3.53) 2(-0.635,-3.53) 3(0.635,-3.53) 4(1.905,-3.53) 5(1.905,3.53) 6(0.635,3.53) 7(-0.635,3.53) 8(-1.905,3.53)
SOT-223-4_L6.5-W3.5-P2.30-LS7.0-BR
  rect 2.47x0.98 smd: 1(2.835,-2.3) 2(2.835,0) 3(2.835,2.3)
  rect 2.47x3.6 smd: 4(-2.835,0)

## Nets
As in the schematic.

Pads without a net: CN1 4 5 6 7 9 10 11 12; U1 2 3 4 7 8 9 10 11 24 27 28 29 33 37 38 50 55 57 61 62; U2 2; U3 2 3 4 5 6 7 8 9 12 14 15 16 17 19 21 22 25; U5 3 9; U6 4; U33 0 CD

## Via types
v1: diameter 0.61, hole 0.305, Top Layer to Bottom Layer, 85 vias

## Routing (per net, layer and track width the routed paths; a pad name or vN(x,y) marks a point on that pad's centre or on a via; arc(x,y) is an arc through that point)
5V: length 128.3
  Top Layer w0.254: U16.2 6.28,37.72 v1(6.28,35.96) ; 3.24,15.89 3.49,15.89 4.51,14.87 v1(5.27,14.87)
  Inner1 w0.254: H1.2 44.07,34.42 44.07,28.32 H4.2 44.2,25.65 44.2,19.81 H5.2 44.13,17.21 44.13,10.81 44.64,10.3 ; 15.1,10.3 13.9,10.3 7.3,16.91 ; 15.1,10.3 44.64,10.3 ; 15.1,10.3 18.05,7.35 24.31,7.35 27.09,4.58 27.09,3.81 26.55,3.26 25.11,3.26 23.5,1.65 ; 44.64,10.3 45.32,10.3 H6.2 ; v1(5.27,14.87) 7.3,16.91 ; 7.3,16.91 7.3,29.86 4,33.16 4,33.67 v1(6.28,35.96)
  Inner2 w0.254: U8.2 9.38,15.13 5.52,15.13 v1(5.27,14.87)
5V-USB: length 14
  Top Layer w0.254: U6.1 3.37,26.95 v1(3.24,26.95) ; v1(2.47,15.1) 2.98,14.59 D1.1
  Bottom Layer w0.254: v1(3.24,26.95) 3.24,15.86 v1(2.47,15.1)
+3.3V: length 27.7
  Top Layer w0.254: C5.1 29.4,6.35 v1(26.61,6.35) 26.1,5.84 22.29,5.84 21.53,6.6 21.53,13.65 U4.8 ; 22.93,13.75 22.93,9.52 v1(24.58,7.87) 24.19,7.87 23.69,7.37
  Bottom Layer w0.254: v1(26.61,6.35) 26.1,6.35 v1(24.58,7.87)
GND: length 335.4
  Top Layer w0.254: C10.1 16.49,23.33 16.51,23.33 ; 1.42,19.43 3.59,17.27 ; 1.42,19.43 1.42,21.5 U6.6 2.64,22.72 3.91,22.72 ; 1.42,19.43 C2.1 ; 3.59,17.27 2.06,17.27 0.54,15.74 0.54,5.35 MH2.1 ; 3.59,17.27 3.84,17.27 3.96,17.15 ; 3.59,17.27 3.71,17.15 3.96,17.15 ; 3.96,17.15 4.35,16.76 D2.2 10.47,16.76 C9.1 16.26,22.54 16.26,23.07 16.51,23.33 ; 25.25,22.06 25.25,22.57 26.26,23.59 26.51,23.59 26.77,23.84 ; 25.25,22.06 U1.12 25.25,20.03 21.63,16.42 U4.1 21.63,14.95 22.28,14.3 U4.7 22.28,7.37 ; 25.25,22.06 24.78,22.53 23.08,22.53 22.06,23.55 U1.63 16.73,23.55 16.51,23.33 ; U3.11 24.76,40.12 25.25,40.61 27.53,40.61 28.55,39.59 29.56,39.59 30.83,38.32 ; 3.91,22.72 3.91,23.23 3.66,23.48 3.66,23.63 ; 3.91,22.72 U6.8 ; 21.01,37.12 19.48,37.12 17.2,39.41 17.2,41.69 17.71,42.2 ; 21.01,37.12 21.01,36.87 20.25,36.1 U1.47 20.25,31.38 21.44,30.19 26.77,30.19 27.02,30.45 ; 21.01,37.12 21.01,37.28 U3.1 ; 26.77,23.84 27.02,23.59 v1(27.78,23.59) 29.2,23.59 U1.18 ; 26.77,23.84 26.77,27.91 27.78,28.92 27.78,29.68 ; U3.18 20.28,42.2 17.71,42.2 ; 3.66,23.63 U6.5 ; 3.66,23.63 3.41,23.63 2.39,24.64 2.39,27.11 2.64,27.37 ; U33.6 16.82,43.08 17.71,42.2 ; 27.75,8.25 27.75,11.3 C11.1 ; 27.75,8.25 28.64,8.25 C5.2 ; 27.75,8.25 26.48,8.25 C12.2 24.57,6.35 23.3,6.35 C14.2 ; 2.64,27.37 2.64,27.57 U6.7 1.76,28.75 C3.1 3.24,32.77 C15.1 3.62,32.64 5.14,32.64 5.4,32.89 ; 2.64,27.37 2.9,27.62 4.07,27.62 U6.9 ; 30.83,38.32 30.83,34.26 27.02,30.45 ; 30.83,38.32 37.24,38.32 C6.1 ; 5.4,32.89 5.65,33.15 7.07,33.15 7.87,32.35 U5.7 ; 5.4,32.89 5.4,41.49 U9.4 5.33,43.08 0.84,47.57 0.84,51.82 MH1.1 ; 27.78,29.68 28.15,30.05 U1.31 30.26,30.05 33.93,33.72 C8.2 ; 27.78,29.68 27.02,30.45 ; H6.3 39.24,1.65 +5V.2
  Bottom Layer w0.254: 32.77,23.75 32.01,22.99 32.01,19.3 U24.1 37.97,18.42 U27.1 44.83,15.88 ; 32.77,23.75 U25.1 40.13,30.86 ; 32.77,23.75 27.95,23.75 v1(27.78,23.59) ; 44.83,15.88 44.07,15.11 44.07,9.02 H6.3 45.34,5.29 MH4.1 ; 44.83,15.88 45.34,15.88 H5.3 ; 47.12,53.59 43.18,53.59 41.66,55.12 31.24,55.12 29.84,53.72 29.84,53.47 29.97,53.34 29.97,52.58 ; 47.12,53.59 47.12,48.51 H3.2 47.12,44.96 47.12,34.93 H1.3 42.42,33.15 40.13,30.86 ; 47.12,53.59 MH3.1 ; 40.13,30.86 40.39,30.86 44.2,27.05 44.2,25.65 H4.3
VDD: length 169.1
  Top Layer w0.254: 38.74,39.88 38.99,39.62 38.99,38.17 C7.2 37.47,36.64 36.19,36.64 30.35,30.8 ; 38.74,39.88 35.18,39.88 U11.2 34.29,40.01 29.34,40.01 U13.2 24.4,42.16 24.11,41.88 ; 38.74,39.88 44.07,45.21 44.07,48.01 H3.1 42.8,51.82 39.61,51.82 CN1.1 ; 23.35,45.94 24.11,46.7 24.11,50.42 ; 23.35,45.94 24.11,45.18 24.11,41.88 ; 23.35,45.94 22.84,46.45 16.13,46.45 14.86,45.18 ; v1(30.86,23.12) 30.86,23.63 30.44,24.05 U1.19 ; C13.2 17.84,6.48 14.67,6.48 14.16,6.99 ; v1(14.92,15.36) 14.16,14.61 ; 14.16,14.61 14.16,6.99 ; 14.16,14.61 U2.4 ; U1.1 v1(19.24,21.05) 19.24,21.56 U1.64 ; U33.4 14.86,44.67 14.86,45.18 ; U1.13 25.7,21 25.7,18.55 v1(24.94,17.79) ; 30.35,30.8 v1(30.35,31.05) ; 30.35,30.8 30.1,30.55 U1.32 ; 14.86,45.18 9.9,50.14 2.53,50.14 1.52,49.13 U9.8 ; 14.16,6.99 12.64,5.46 6.29,5.46 6.03,5.72 2.98,5.72 1.92,6.78 LED1.3 ; v1(19.75,28.67) 20,28.67 20.76,29.43 20.76,29.94 19.75,30.95 U1.48 ; 24.11,41.88 U3.13
  Inner1 w0.254: v1(30.86,23.12) 30.86,23.89 31.37,24.39 31.37,30.04 v1(30.35,31.05) ; 19.49,20.7 22.4,17.79 v1(24.94,17.79) ; 19.49,20.7 19.49,19.94 v1(14.92,15.36) ; 19.49,20.7 19.49,20.79 v1(19.24,21.05)
  Inner2 w0.254: v1(19.75,28.67) 20,28.41 20,26.64 19.24,25.87 v1(19.24,21.05)
  Bottom Layer w0.254: v1(30.86,23.12) 30.86,22.62 27.31,19.06 26.21,19.06 v1(24.94,17.79)
+BATT: length 9.9
  Top Layer w0.254: v1(8.38,27.44) 8.38,26.94 U5.2 ; C9.2 12.95,20.89 v1(11.68,22.16)
  Inner1 w0.254: v1(8.38,27.44) 11.68,24.14 v1(11.68,22.16)
BLUE: length 31.7
  Top Layer w0.254: v1(19.27,26.79) 19.01,27.05 U1.56
  Inner2 w0.254: U22.1 20.79,17.18 v1(20.79,17.9)
  Bottom Layer w0.254: v1(19.27,26.79) 22.57,23.49 22.57,19.68 v1(20.79,17.9)
BOOT0: length 36
  Top Layer w0.254: U18.2 41.02,6.81 v1(41.02,12.07) ; v1(23.33,23.27) 21.56,25.05 U1.60
  Inner1 w0.254: v1(30.19,19.21) 30.19,18.58 U27.2 37.72,15.88 U17.1 40.51,12.57 v1(41.02,12.07)
  Inner2 w0.254: v1(23.33,23.27) 23.33,21.75 26.13,18.95 29.94,18.95 v1(30.19,19.21)
CLK: length 17.5
  Top Layer w0.254: U1.53 16.73,28.55 15.46,29.82 15.46,44.17 U33.5
CMD: length 18.9
  Top Layer w0.254: U33.3 13.52,31 16.47,28.05 U1.54
CS_BARO: length 15.5
  Top Layer w0.254: U4.2 22.28,15.46 23.5,16.67 24.77,16.67 29.34,21.25 v1(29.34,22.01) ; U1.20 30.51,24.55 v1(30.77,24.8)
  Inner1 w0.254: v1(30.77,24.8) 29.34,23.37 v1(29.34,22.01)
CS_FLASH: length 25.6
  Top Layer w0.254: v1(20.99,34.07) 21.25,33.82 U1.45 ; v1(0.81,41.56) U9.1
  Inner1 w0.254: v1(0.81,41.56) 13.51,41.56 v1(20.99,34.07)
GPS_RX: length 48.1
  Top Layer w0.254: v1(26.75,23.04) U1.15
  Inner2 w0.254: v1(26.75,23.04) 27,23.29 27,29.14 25.98,30.15 25.98,54.69 26.77,55.47 36.6,55.47 37.47,54.61 37.47,52.83
GPS_TX: length 47.9
  Top Layer w0.254: v1(26.33,19.69) 26.25,19.78 U1.14
  Inner2 w0.254: v1(26.33,19.69) 26.33,20.62 28.45,22.74 28.45,26.42 27.43,27.43 27.43,34.04 28.19,34.8 28.19,54.36 28.96,55.12 35.31,55.12 36.32,54.1 36.32,52.71
GREEN: length 34.2
  Top Layer w0.254: U21.1 24.42,5.37 29.75,5.37 31.53,7.15 31.53,15.86 32.55,16.88 32.8,16.88 34.07,18.15 34.07,24.5 33.56,25.01 33.06,25.01 30.51,27.55 U1.26
GYRO_SCL: length 19.1
  Inner2 w0.254: U14.2 39.5,27.56 39.5,44.7 U12.2
GYRO_SDA: length 19.1
  Inner1 w0.254: U15.2 40.89,29.34 40.89,46.61 U19.2
MISO_BARO: length 17.7
  Top Layer w0.254: 22.93,15.2 22.93,14.95 23.4,14.48 23.76,14.48 24.16,14.88 24.16,15.39 31.53,22.75 31.53,25.29 31.28,25.55 U1.22
MISO_FLASH: length 28.3
  Top Layer w0.254: U1.35 26.25,33.82 v1(23.96,36.1) ; U9.5 8.65,48.62 v1(11.51,45.76)
  Inner1 w0.254: v1(23.96,36.1) 21.93,38.14 19.13,38.14 v1(11.51,45.76)
MOSI_BARO: length 17.3
  Top Layer w0.254: v1(29.5,19.7) 29.5,19.44 23.81,13.75 U4.5 ; U1.23 30.51,26.05 v1(30.77,26.3)
  Inner2 w0.254: v1(30.77,26.3) 30.01,25.54 30.01,20.21 v1(29.5,19.7)
MOSI_FLASH: length 36.2
  Top Layer w0.254: U9.6 4.06,48.13 5.17,47.03 8.47,47.03 8.98,46.52 8.98,44.48 7.71,43.22 v1(7.71,40.93) ; v1(24.98,31.02) 25.24,31.02 25.75,31.53 U1.36
  Inner1 w0.254: v1(7.71,40.93) 11.01,40.93 21.68,30.26 24.22,30.26 v1(24.98,31.02)
MOTOR1: length 19.7
  Bottom Layer w0.254: H1.1 43.05,38.23 31.88,49.4 31.5,49.4 U34.2
MOTOR2: length 23.1
  Inner2 w0.254: H4.1 41.15,33.78 41.15,49.02 U29.2
MOTOR3: length 30.6
  Inner2 w0.254: U28.2 30.73,44.83 30.73,34.8 40.13,25.4 41.15,25.4 H5.1
MOTOR4: length 42.4
  Inner2 w0.254: H6.1 41.53,16.64 41.53,18.78 34.16,26.14 34.16,30.61 29.34,35.43 29.34,38.23 30.1,38.99 30.1,44.07 29.59,44.58 29.59,46.61 U30.2
RED: length 30.6
  Top Layer w0.254: v1(27.72,25.52) 27.47,25.78 27.47,26.54 27.97,27.05 U1.25
  Bottom Layer w0.254: v1(27.72,25.52) 27.21,25.52 23.15,21.46 23.15,16.89 14,7.74 14,4.1 U20.1
SCK_BARO: length 13.1
  Top Layer w0.254: U4.4 23.66,15.28 v1(23.66,15.9) ; v1(27.72,24.54) 28.23,25.05 U1.21
  Bottom Layer w0.254: v1(27.72,24.54) 27.21,24.54 23.66,20.98 v1(23.66,15.9)
SCK_FLASH: length 30.2
  Top Layer w0.254: v1(3.26,42.83) 3.26,42.02 U9.2 ; U1.34 v1(26.75,34.33)
  Inner1 w0.254: v1(26.75,34.33) 25.73,35.34 20.4,35.34 13.67,42.06 4.02,42.06 v1(3.26,42.83)
SD_DAT0: length 15
  Top Layer w0.254: v1(18.91,42.96) 17.92,43.95 U33.7 ; U1.39 24.25,34.07 v1(23.99,34.33)
  Inner2 w0.254: v1(23.99,34.33) 23.23,34.33 20.18,37.37 20.18,41.69 v1(18.91,42.96)
SD_DAT1: length 19.8
  Top Layer w0.254: v1(24,31.02) 23.75,31.28 U1.40 ; v1(19.68,43.06) 19.02,43.72 U33.8
  Inner2 w0.254: v1(19.68,43.06) 19.17,43.57 18.41,43.57 18.16,43.32 18.16,42.71 18.41,42.45 18.41,37.63 24,32.04 v1(24,31.02)
SD_DAT2: length 18.9
  Top Layer w0.254: U33.1 10.66,43.77 v1(10.63,43.77) ; U1.51 16.73,29.55 15.97,30.31 15.97,37.68 v1(16.22,37.93)
  Bottom Layer w0.254: v1(16.22,37.93) 16.22,38.18 v1(10.63,43.77)
SD_DAT3: length 19.5
  Top Layer w0.254: v1(12.92,36.16) 12.42,36.66 U33.2 ; U1.52 18.76,29.05 19.27,29.56 v1(19.27,29.81)
  Bottom Layer w0.254: v1(19.27,29.81) v1(12.92,36.16)
SWCLK: length 37.7
  Top Layer w0.254: U1.49 19.5,30.55 20.01,30.04 v1(20.01,29.53)
  Bottom Layer w0.254: v1(20.01,29.53) 20.77,30.29 38.29,30.29 44.83,36.83 46.1,36.83 46.61,37.34 46.61,40.39 H3.4
SWDIO: length 36.6
  Top Layer w0.254: U1.46 20.7,32.5 20.7,31.57 21.29,30.99 v1(21.97,30.99)
  Inner1 w0.254: H3.3 40.77,48.77 39.5,48.77 28.32,37.59 28.32,35.05 25.14,31.87 22.85,31.87 v1(21.97,30.99)
$1N1: length 25.5
  Top Layer w0.254: v1(27.47,22.79) 28.99,22.79 U1.17
  Inner1 w0.254: v1(27.47,22.79) 26.96,22.29 22.39,22.29 v1(21.88,22.79)
  Bottom Layer w0.254: v1(21.88,22.79) 15.28,16.19 9.97,16.19 U7.2
$1N2: length 22.8
  Top Layer w0.254: v1(5.66,21.73) 5.91,21.99 5.91,24.78 4.9,25.8 U6.2
  Inner2 w0.254: U7.1 7.87,8.59 4.39,12.08 4.39,20.46 v1(5.66,21.73)
$1N3: length 17.6
  Top Layer w0.254: U23.2 28.26,35.75 v1(28.26,34) ; v1(28.51,21.81) 27.75,21.05 U1.16
  Inner2 w0.254: v1(28.26,34) 29.02,33.24 29.02,22.57 28.51,22.06 v1(28.51,21.81)
$1N4: length 39.7
  Top Layer w0.254: v1(5.15,24.64) 4.64,25.15 U6.3
  Inner1 w0.254: v1(25.22,28.96) 33.09,36.83 U23.1
  Inner2 w0.254: v1(5.15,24.64) 5.15,26.42 10.74,32 19.37,32 21.15,30.23 23.95,30.23 v1(25.22,28.96)
$1N7: length 33.9
  Top Layer w0.254: v1(30.77,28.32) 30.77,29.08 30.3,29.55 U1.30 ; v1(15.6,23.24) 14.58,22.23 12.55,22.23 11.79,22.99 11.53,22.99 7.72,19.18 C2.2
  Bottom Layer w0.254: v1(15.6,23.24) 18.65,26.29 18.65,27.05 19.66,28.07 30.51,28.07 v1(30.77,28.32)
$1N9: length 34.3
  Top Layer w0.254: C3.2 1.84,30.99 ; 1.84,30.99 v1(2.35,30.99) ; 1.84,30.99 1.84,31.75 1.08,32.51 1.08,37.12 X1.2 ; U1.5 21.71,21.08 21.71,22.1 21.2,22.61 v1(20.13,22.61)
  Bottom Layer w0.254: v1(2.35,30.99) 6.41,30.99 14.79,22.61 v1(20.13,22.61)
$1N10: length 30.2
  Top Layer w0.254: 2.73,33.66 4.51,33.66 v1(4.76,33.4) ; 2.73,33.66 C15.2 ; 2.73,33.66 2.73,36.05 X1.1 ; U1.6 22.25,20.03 21.9,19.69 18.22,19.69 v1(16.44,21.46)
  Inner1 w0.254: v1(4.76,33.4) 4.76,33.15 v1(16.44,21.46)
$1N15: length 17.3
  Top Layer w0.254: C8.1 34.93,32.32 v1(34.16,33.08) ; v1(30.1,38.16) 26.29,38.16 24.76,39.69 24.42,39.69 U3.10
  Bottom Layer w0.254: v1(34.16,33.08) 34.16,34.1 v1(30.1,38.16)
$1N18: length 34.4
  Top Layer w0.254: v1(28.07,7.17) 27.44,7.17 C12.1 ; C7.1 38.74,34.99 38.74,20.26 v1(32.64,14.16)
  Bottom Layer w0.254: v1(32.64,14.16) 28.07,9.59 v1(28.07,7.17)
$1N20: length 19.9
  Top Layer w0.254: v1(19.59,40.12) U3.20 ; C6.2 29.72,40.58 v1(29.21,41.09)
  Inner1 w0.254: v1(29.21,41.09) 28.7,40.58 20.05,40.58 v1(19.59,40.12)
$1N23: length 35.3
  Top Layer w0.254: D1.3 1.34,15.38 2.58,16.62 3.85,16.62 4.87,15.61 5.63,15.61 5.92,15.31 5.92,14.55 7.41,13.07 10.96,13.07 11.47,13.58 11.47,16.37 11.98,16.88 14.52,16.88 14.77,16.62 14.77,16.37 18.86,12.28 18.86,8.38 ; C1.2 16.06,8.38 18.86,8.38 ; 18.86,8.38 19.37,8.38 C13.1
$1N24: length 13
  Top Layer w0.254: 18.84,16.91 20.36,15.38 20.36,13.82 20,13.46 v1(18.73,13.46) ; C1.1 v1(17.21,7.37)
  Inner2 w0.254: v1(18.73,13.46) 17.21,11.94 v1(17.21,7.37)
$1N49: length 33.2
  Top Layer w0.254: U9.3 4.06,42.32 v1(4.57,42.83)
  Inner2 w0.254: v1(24.89,43.08) 23.11,43.08 22.1,44.09 18.03,44.09 16.76,42.83 v1(4.57,42.83)
  Bottom Layer w0.254: v1(24.89,43.08) 25.15,43.33 33.63,43.33 U13.1
$1N50: length 29.1
  Top Layer w0.254: v1(6.35,45.82) 5.08,45.82 2.79,48.11 U9.7
  Inner1 w0.254: v1(6.35,45.82) 7.11,46.58 11.68,46.58 18.77,39.5 U11.1
$1N54: length 26.6
  Top Layer w0.254: v1(24.78,34.33) 24.78,34.58 24.27,35.09 23.76,35.09 22.75,34.07 U1.42
  Bottom Layer w0.254: U29.1 31.24,51.31 30.23,51.31 24.27,45.35 24.27,41.95 24.78,41.44 v1(24.78,34.33)
$1N55: length 12.7
  Top Layer w0.254: v1(23.01,36.1) 22.25,35.34 U1.43
  Bottom Layer w0.254: v1(23.01,36.1) 23.01,44.94 U28.1
$1N56: length 15.8
  Top Layer w0.254: U1.44 21.75,35.85 v1(22.25,36.36)
  Bottom Layer w0.254: v1(22.25,36.36) 22,36.61 22,46.64 U30.1
$1N58: length 22.1
  Top Layer w0.254: v1(17.81,41.42) 18.57,40.66 18.57,38.63 19.08,38.12 U3.24
  Inner1 w0.254: v1(17.81,41.42) 24.67,41.42 29.75,46.5 31.13,46.5 U19.1
$1N60: length 18.1
  Top Layer w0.254: U3.23 19.59,38.62 v1(19.34,38.87)
  Inner1 w0.254: U12.1 32.14,44.95 32.14,42.94 27.57,38.37 25.94,38.37 25.43,38.87 v1(19.34,38.87)
$1N63: length 15.8
  Top Layer w0.254: U1.58 22.32,26.05 v1(22.69,26.42)
  Bottom Layer w0.254: v1(22.69,26.42) 23.19,26.92 32.51,26.92 U14.1
$1N64: length 16.7
  Top Layer w0.254: v1(26.38,28.85) 23.08,25.55 U1.59
  Bottom Layer w0.254: v1(26.38,28.85) 26.62,29.08 U15.1
$1N71: length 22.2
  Top Layer w0.254: U1.41 23.25,31.28 v1(22.99,31.02)
  Bottom Layer w0.254: U34.1 21.47,48.77 21.47,36.1 22.99,34.58 v1(22.99,31.02)
$1N83: length 7.4
  Top Layer w0.254: C16.2 12.06,25.47 7.31,25.47 6.6,26.17 U5.1
$1N84: length 25.5
  Top Layer w0.254: 8.06,23.63 D2.1 8.2,23.56 ; 8.06,23.63 5.84,25.84 ; 8.06,23.63 8.13,23.56 8.2,23.56 ; 8.06,23.63 7.87,23.63 5.84,25.66 5.84,25.84 ; 5.84,25.84 5.84,30.42 ; 8.2,23.56 12.57,23.56 C16.1 ; 5.84,30.42 6.6,31.18 8.26,31.18 8.51,31.43 8.51,32.96 U16.1 ; 5.84,30.42 5.84,31.48 U5.8
$1N87: length 37
  Top Layer w0.254: v1(16.26,24.96) C10.2 9.14,32.07 U5.6
  Inner1 w0.254: v1(16.26,24.96) 16.76,24.96 20.57,21.15 31.5,21.15 32.51,20.13 39.69,20.13 U26.2
$1N88: length 11.6
  Top Layer w0.254: U26.1 27.05,15.11 C11.2
$1N90: length 37.9
  Top Layer w0.254: U5.4 10.92,25.92 12.95,25.92 v1(14.99,23.89)
  Inner1 w0.254: U25.2 41.66,22.73 41.66,20.7 40.64,19.69 32.37,19.69 31.36,20.7 20.43,20.7 17.25,23.89 v1(14.99,23.89)
$1N93: length 58
  Top Layer w0.254: v1(10.92,31.23) 10.41,31.74 U5.5
  Inner2 w0.254: U24.2 39.38,19.55 32.51,19.55 31.5,18.53 10.41,18.53 ; U8.1 11.43,7.49 11.43,14.72 10.41,15.74 10.41,18.53 ; 10.41,18.53 10.41,19.29 10.92,19.8 v1(10.92,31.23)
$1N107: length 7.4
  Top Layer w0.254: U17.2 32.89,8.94 U18.1
$1N112: length 9.6
  Top Layer w0.254: LED1.2 6.35,9.52 v1(6.35,6.22)
  Inner2 w0.254: v1(6.35,6.22) U20.2
$1N113: length 14.3
  Top Layer w0.254: LED1.1 4.69,6.85 v1(5.19,6.34)
  Inner1 w0.254: v1(5.19,6.34) 6.47,5.07 11.54,5.07 13.58,3.04 14.47,3.04 U21.2
$1N114: length 28.9
  Top Layer w0.254: v1(12.59,7.12) 5.98,13.72 2.93,13.72 1.92,12.71 LED1.4
  Inner1 w0.254: U22.2 25.01,5.34 14.36,5.34 v1(12.59,7.12)

## Copper pours and planes (outline as drawn; the poured copper is in the pictures)
GND on Top Layer: 0.89,53.47 47.45,53.47 47.45,0.16 0.89,0.16
